# EAGLE design BitBang Rev 1 - Route 1 (EAGLE 5.11)
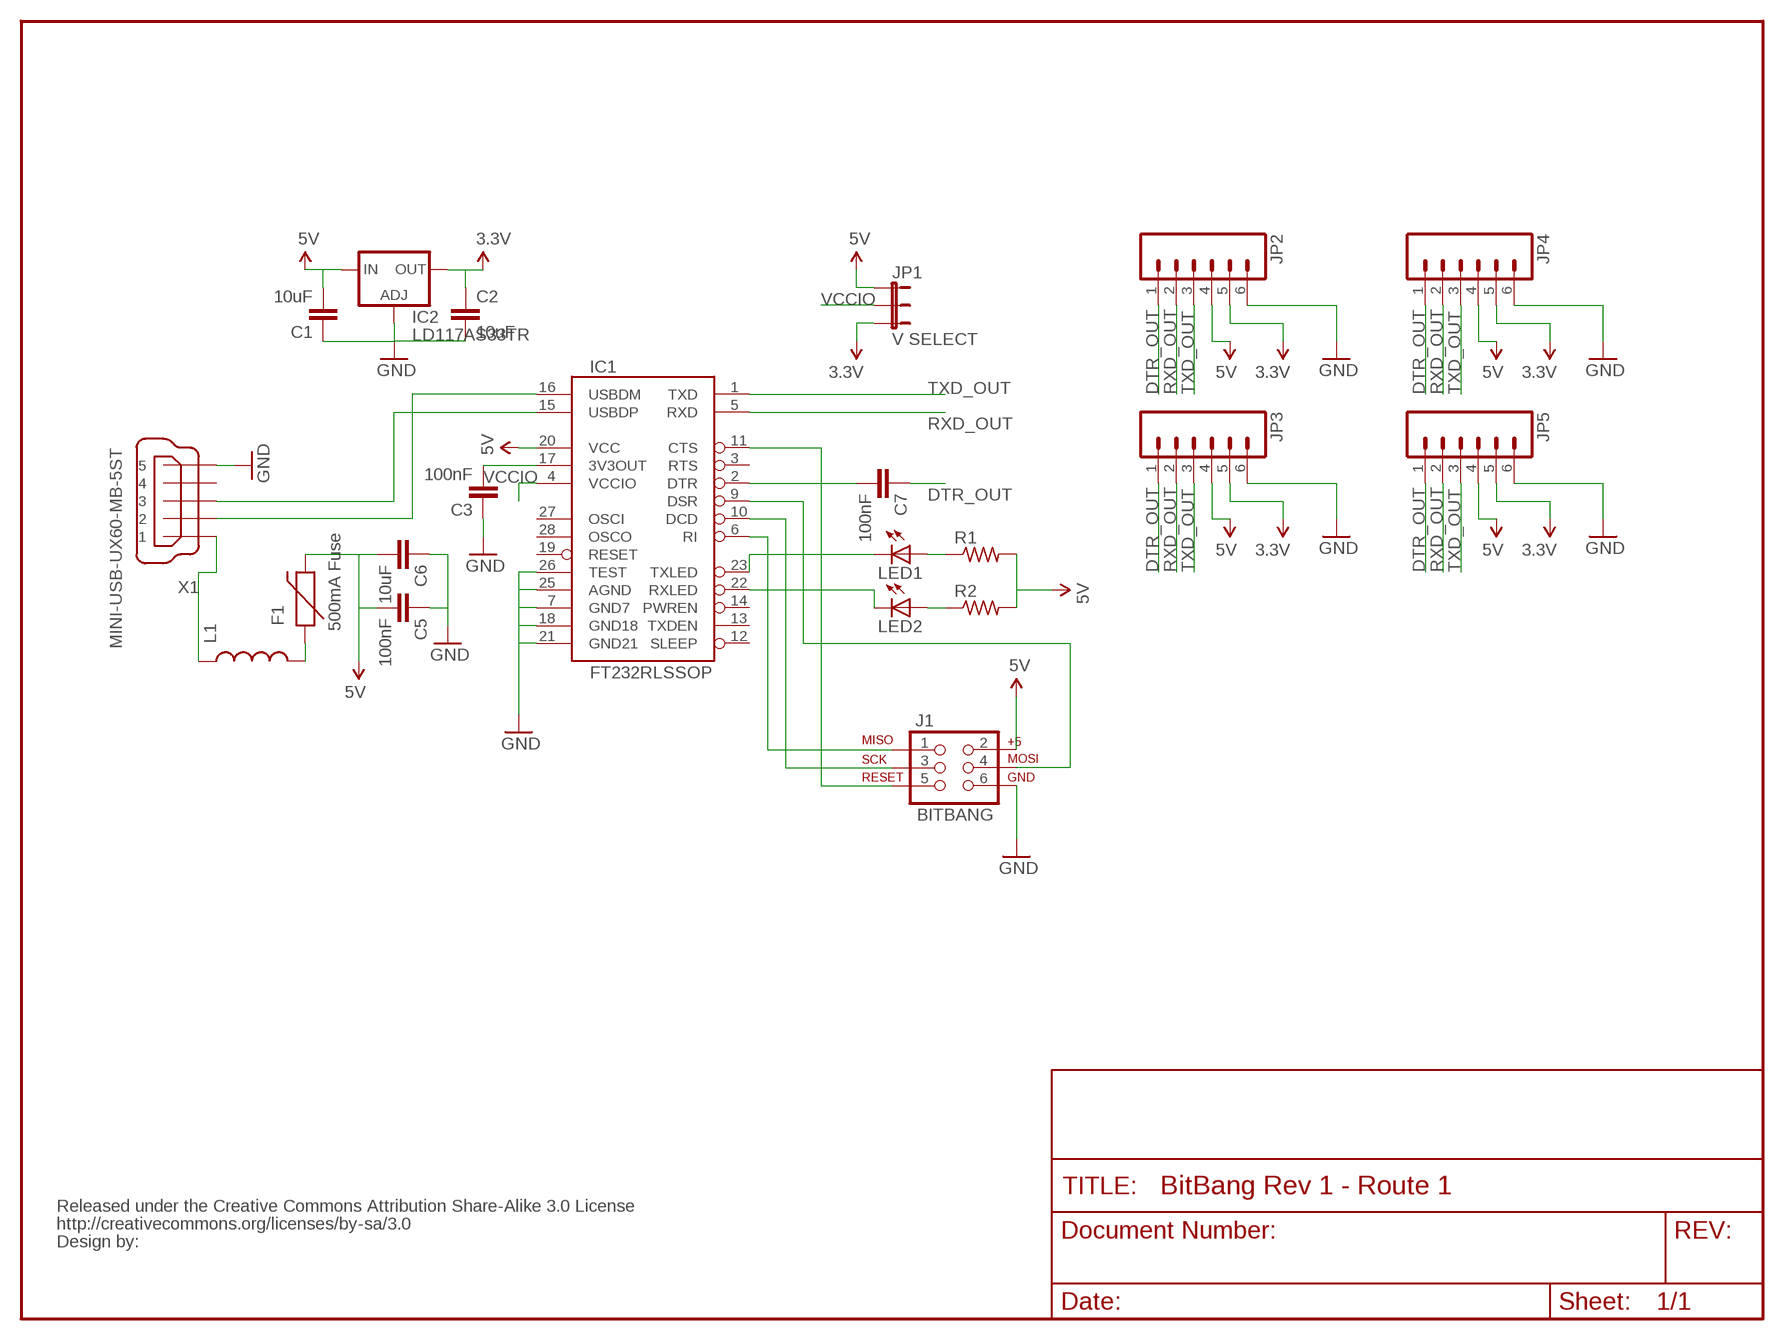
[diagram p0: schematic, sheet 1]

## Parts
C1  10uF  CAP0805  [0805]
C2  10uF  CAP0805  [0805]
C3  100nF  CAP0805  [0805]
C5  100nF  CAP0805  [0805]
C6  10uF  CAP0805  [0805]
C7  100nF  CAP0805  [0805]
F1  500mA Fuse  PTCSMD  [PTC-1206]
IC1  FT232RLSSOP  [SSOP28DB]
IC2  LD117AS33TR  [SOT223]
J1  BITBANG  AVR_SPI_PRG_6NS  [2X3-NS]
JP1  V SELECT  JUMPER-3PTH  [1X03]
JP2  M06SIP  [1X06]
JP3  M06SIP  [1X06]
JP4  M06SIP  [1X06]
JP5  M06SIP  [1X06]
L1  INDUCTOR0805  [0805]
LED1  LEDCHIP-LED0805  [CHIP-LED0805]
LED2  LEDCHIP-LED0805  [CHIP-LED0805]
R1  R-US_R0805  [R0805]
R2  R-US_R0805  [R0805]
U$6  CREATIVE_COMMONS  [CREATIVE_COMMONS]
X1  MINI-USB-UX60-MB-5ST  [UX60-MB-5ST]

## Nets
3.3V: C2.1 IC2.4(OUT) JP1.3 JP2.5 JP3.5 JP4.5 JP5.5
5V: C1.2 C5.2 C6.2 F1.2 IC1.20(VCC) IC2.3(IN) J1.2 JP1.1 JP2.4 JP3.4 JP4.4 JP5.4 R1.2 R2.2
DTR_OUT: C7.1 JP2.1 JP3.1 JP4.1 JP5.1
GND: C1.1 C2.2 C3.1 C5.1 C6.1 IC1.7(GND7) IC1.18(GND18) IC1.21(GND21) IC1.25(AGND) IC1.26(TEST) IC2.1(ADJ) J1.6 JP2.6 JP3.6 JP4.6 JP5.6 X1.5
N$1: IC1.16(USBDM) X1.2
N$2: IC1.15(USBDP) X1.3
N$3: F1.1 L1.2
N$4: C7.2 IC1.2(DTR)
N$5: IC1.11(CTS) J1.5
N$6: IC1.9(DSR) J1.4
N$7: IC1.10(DCD) J1.3
N$8: C3.2 IC1.17(3V3OUT)
N$9: IC1.6(RI) J1.1
N$10: L1.1 X1.1
N$13: IC1.23(TXLED) LED1.C
N$14: IC1.22(RXLED) LED2.C
N$15: LED1.A R1.1
N$16: LED2.A R2.1
RXD_OUT: IC1.5(RXD) JP2.2 JP3.2 JP4.2 JP5.2
TXD_OUT: IC1.1(TXD) JP2.3 JP3.3 JP4.3 JP5.3
VCCIO: IC1.4(VCCIO) JP1.2
Unconnected: IC1.3(RTS) IC1.12(SLEEP) IC1.13(TXDEN) IC1.14(PWREN) IC1.19(RESET) IC1.27(OSCI) IC1.28(OSCO) X1.4

## Library data of the parts
C1-C3 C5-C7 = SparkFun:CAP: Capacitor Standard 0603 ceramic capacitor, and 0.1" leaded capacitor.
F1 = SparkFun:PTC: Resettable Fuse PTC Resettable Fuse. Spark Fun Electronics SKU : COM-08357
IC1 = SparkFun:FT232RL: USB UART FT232RL 4th Generation USB UART (USB <-> Serial) Controller. Spark Fun Electronics SKU : COM-00650
IC2 = v-reg:LD117A?*: Low drop fixed and adjustable positive voltage regulators 1 A Source: http://www.st.com/stonline/products/literature/ds/7194/ld1117axx.pdf
J1 = SparkFun:AVR_SPI_PRG_6: AVR ISP 6 Pin This is the reduced ISP connector for AVR programming. Common on Arduino. This footprint will take up less PCB space and can be used with a 10-pin to 6-pin adapter such as SKU: BOB-08508
JP1 = SparkFun:JUMPER-3
JP2-JP5 = SparkFun:M06: Header 6 Standard 6-pin 0.1" header. Use with straight break away headers (SKU : PRT-00116), right angle break away headers (PRT-00553), swiss pins (PRT-00743), machine pins (PRT-00117), and female headers (PRT-00115). Molex polarized connector foot print use with SKU : PRT-08094 with associated crimp pins and housings. NOTES ON THE VARIANTS LOCK and LOCK_LONGPADS... This footprint was designed to help hold the alignment of a through-hole component (i.e. 6-pin header) while soldering it into place. You may notice that each hole has been shifted either up or down by 0.005 of an inch from it's more standard position (which is a perfectly straight line). This slight alteration caused the pins (the squares in the middle) to touch the edges of the holes. Because they are alternating, it causes a "brace" to hold the component in place. 0.005 has proven to be the perfect amount of "off-center" position when using our standard breakaway headers. Although looks a little odd when you look at the bare footprint, once you have a header in there, the alteration is very hard to notice. Also, if you push a header all the way into place, it is covered up entirely on the bottom side. This idea of altering the position of holes to aid alignment will be further integrated into the Sparkfun Library for other footprints. It can help hold any component with 3 or more connection pins.
L1 = SparkFun:INDUCTOR: Inductors Basic Inductor/Choke - 0603 and 1206. Footprints are not proven and vary greatly between part numbers.
LED1 LED2 = led:LED: LED OSRAM: - CHIPLED LG R971, LG N971, LY N971, LG Q971, LY Q971, LO R971, LY R971 LH N974, LH R974 LS Q976, LO Q976, LY Q976 LO Q996 - Hyper CHIPLED LW Q18S LB Q993, LB Q99A, LB R99A - SideLED LS A670, LO A670, LY A670, LG A670, LP A670 LB A673, LV A673, LT A673, LW A673 LH A674 LY A675 LS A676, LA A676, LO A676, LY A676, LW A676 LS A679, LY A679, LG A679 - Hyper Micro SIDELED® LS Y876, LA Y876, LO Y876, LY Y876 LT Y87S - SmartLED LW L88C, LW L88S LB L89C, LB L89S, LG L890 LS L89K, LO L89K, LY L89K LS L896, LA L896, LO L896, LY L896 - TOPLED LS T670, LO T670, LY T670, LG T670, LP T670 LSG T670, LSP T670, LSY T670, LOP T670, LYG T670 LG T671, LOG T671, LSG T671 LB T673, LV T673, LT T673, LW T673 LH T674 LS T676, LA T676, LO T676, LY T676, LB T676, LH T676, LSB T676, LW T676 LB T67C, LV T67C, LT T67C, LS T67K, LO T67K, LY T67K, LW E67C LS E67B, LA E67B, LO E67B, LY E67B, LB E67C, LV E67C, LT E67C LW T67C LS T679, LY T679, LG T679 LS T770, LO T770, LY T770, LG T770, LP T770 LB T773, LV T773, LT T773, LW T773 LH T774 LS E675, LA E675, LY E675, LS T675 LS T776, LA T776, LO T776, LY T776, LB T776 LHGB T686 LT T68C, LB T68C - Hyper Mini TOPLED® LB M676 - Mini TOPLED Santana® LG M470 LS M47K, LO M47K, LY M47K Source: http://www.osram.convergy.de LUXEON: - LUMILED® LXK2-PW12-R00, LXK2-PW12-S00, LXK2-PW14-U00, LXK2-PW14-V00 LXK2-PM12-R00, LXK2-PM12-S00, LXK2-PM14-U00 LXK2-PE12-Q00, LXK2-PE12-R00, LXK2-PE12-S00, LXK2-PE14-T00, LXK2-PE14-U00 LXK2-PB12-K00, LXK2-PB12-L00, LXK2-PB12-M00, LXK2-PB14-N00, LXK2-PB14-P00, LXK2-PB14-Q00 LXK2-PR12-L00, LXK2-PR12-M00, LXK2-PR14-Q00, LXK2-PR14-R00 LXK2-PD12-Q00, LXK2-PD12-R00, LXK2-PD12-S00 LXK2-PH12-R00, LXK2-PH12-S00 LXK2-PL12-P00, LXK2-PL12-Q00, LXK2-PL12-R00 Source: www.luxeon.com KINGBRIGHT: KA-3528ASYC Source: www.kingbright.com
R1 R2 = resistor:R-US_: RESISTOR, American symbol
U$6 = SparkFun:CREATIVE_COMMONS
X1 = con-hirose:MINI-USB-: MINI USB Connector Source: http://www.hirose.co.jp/cataloge_hp/e24000019.pdf; OC_FARNELL: unknown; OC_NEWARK: unknown

## Board
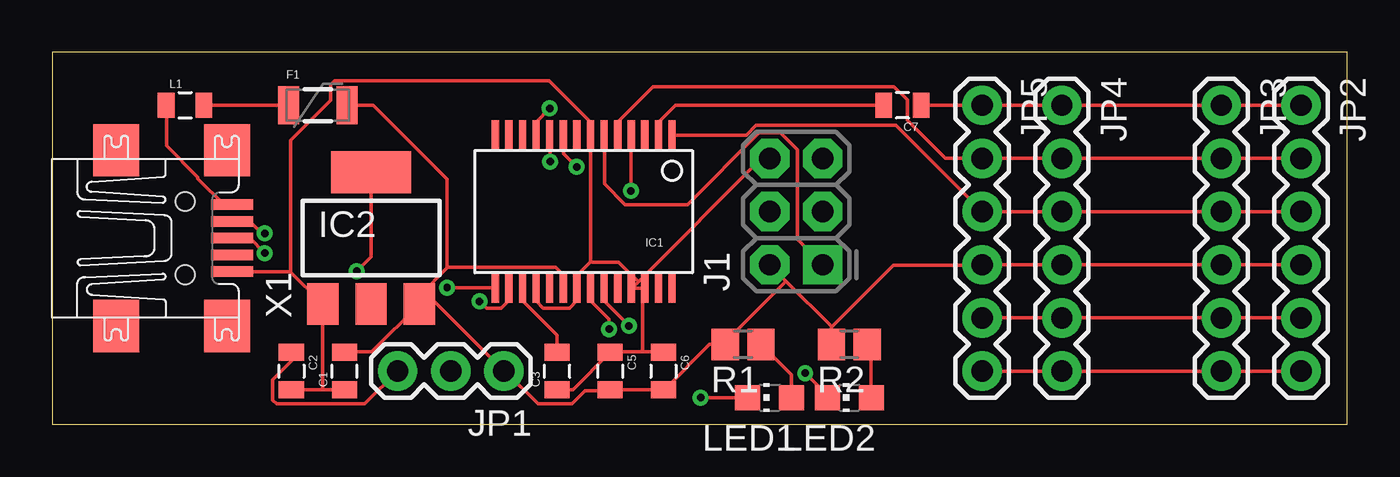
[diagram p1: board, top side]
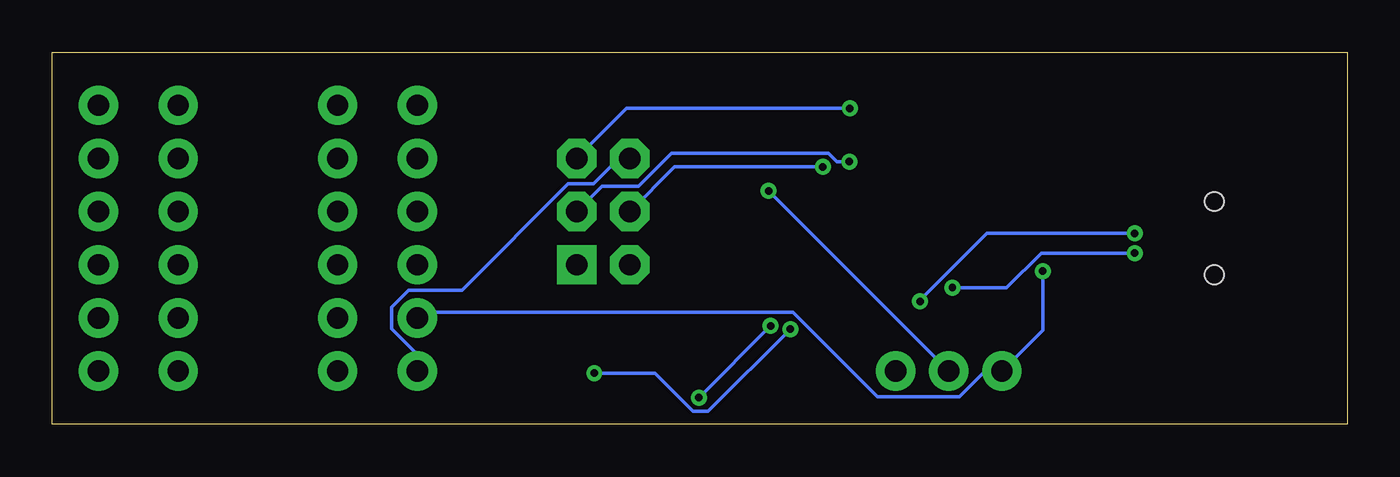
[diagram p2: board, bottom side, seen from below]

Size 61.9 x 17.77 mm. Coordinates in mm from the lower left corner, seen from the top.
Outline: 0,0 61.9,0 61.9,17.77 0,17.77 0,0
Copper layers (1*16): Top 0.0356mm / dielectric 1.5011mm / Bottom 0.0356mm
Design rules "SilverCircuits": minimum track width 7mil, minimum drill 14mil, track to track 7mil, track to pad 7mil, pad to pad 7mil, via to via 7mil, smd to smd 0mil, copper to edge 20mil, drill to drill 8mil, minimum pad ring 10mil, minimum via ring 8mil, stop-mask expansion 4mil, vias tented up to drill 0mil, thermal gap 10mil

### Footprints (pad centres in the part's own frame; a part is rotated, then mirrored left to right if it is on the bottom)
0805 = smd 0.8 x 1.2: 1 -0.9,0; 2 0.9,0
PTC-1206 = smd 1 x 1.8: 1 -1.4,0; 2 1.4,0
SSOP28DB = smd 0.348 x 1.397: 1 -4.225,-3.656; 2 -3.575,-3.656; 3 -2.925,-3.656; 4 -2.275,-3.656; 5 -1.625,-3.656; 6 -0.975,-3.656; 7 -0.325,-3.656; 8 0.325,-3.656; 9 0.975,-3.656; 10 1.625,-3.656; 11 2.275,-3.656; 12 2.925,-3.656; 13 3.575,-3.656; 14 4.225,-3.656; 15 4.225,3.656; 16 3.575,3.656; 17 2.925,3.656; 18 2.275,3.656; 19 1.625,3.656; 20 0.975,3.656; 21 0.325,3.656; 22 -0.325,3.656; 23 -0.975,3.656; 24 -1.625,3.656; 25 -2.275,3.656; 26 -2.925,3.656; 27 -3.575,3.656; 28 -4.225,3.656
SOT223 = smd 1.5 x 2: 1 -2.3,-3.15; 2 0,-3.15; 3 2.3,-3.15 | smd 3.8 x 2: 4 0,3.15
2X3-NS = drill 1.016 pad 1.88 square: 1 -2.54,-1.27 | drill 1.016 pad 1.88 octagon: 2 -2.54,1.27; 3 0,-1.27; 4 0,1.27; 5 2.54,-1.27; 6 2.54,1.27
1X03 = drill 1.016 pad 1.88 round: 1 0,0; 2 2.54,0; 3 5.08,0
1X06 = drill 1.016 pad 1.88 round: 1 0,0; 2 2.54,0; 3 5.08,0; 4 7.62,0; 5 10.16,0; 6 12.7,0
CHIP-LED0805 = smd 1.2 x 1.2: A 0,-1.05; C 0,1.05
R0805 = smd 1.3 x 1.5: 1 -0.85,0; 2 0.85,0
UX60-MB-5ST = smd 2 x 0.5: 1 2.25,1.6; 2 2.25,0.8; 3 2.25,0; 4 2.25,-0.8; 5 2.25,-1.6 | smd 2.2 x 2.5: M1 -3.3,-4.2; M2 -3.3,4.2; M3 2,4.2; M4 2,-4.2 | hole 0.9: 0,-1.75; 0,1.75

### Placement (x,y rotation side)
C1  13.97,2.54 90 top
C2  11.43,2.54 270 top
C3  24.13,2.54 90 top
C5  26.67,2.54 270 top
C6  29.21,2.54 270 top
C7  40.64,15.24 180 top
F1  12.7,15.24 0 top
IC1  25.4,10.16 180 top
IC2  15.24,8.89 0 top
J1  35.56,10.16 90 top
JP1  21.59,2.54 180 top
JP2  59.69,15.24 270 top
JP3  55.88,15.24 270 top
JP4  48.26,15.24 270 top
JP5  44.45,15.24 270 top
L1  6.35,15.24 0 top
LED1  34.29,1.27 90 top
LED2  38.1,1.27 90 top
R1  33.02,3.81 180 top
R2  38.1,3.81 180 top
U$6  -77.47,24.13 0 top  (outside the outline)
X1  6.35,8.89 0 top

### Tracks (layer width: path | path; a pad name or v marks a point on that pad's centre or on a via)
3.3V  (via drill 0.36)
  Top 0.178: JP1.3 14.94,0.96 10.72,0.96 10.54,1.14 10.54,2.13 11.43,3.02 C2.1 | v14.55,7.32 15.24,8 IC2.4 | JP5.5 JP4.5 JP3.5 JP2.5
  Bottom 0.178: v14.55,7.32 14.55,4.5 JP1.3 16.59,2.52 17.35,2.52 18.54,1.32 22.45,1.32 26.49,5.36 44.17,5.36 JP5.5
5V
  Top 0.178: JP2.4 JP3.4 JP4.4 JP5.4 44.37,7.59 40.21,7.59 37.31,4.7 37.24,4.67 | 37.24,4.67 37.24,3.81 R2.2 | 35.08,6.83 J1.2 | 35.08,6.83 37.24,4.67 | 35.08,6.83 32.21,3.96 32.21,3.89 R1.2 31.42,3.81 29.29,1.68 C6.2 29.21,1.65 26.67,1.65 C5.2 26.59,1.6 25.48,1.6 24.84,0.96 23.22,0.96 21.67,2.52 JP1.1 17.8,6.33 IC2.3 | C1.2 13.97,3.45 15.27,3.45 17.53,5.71 IC2.3 | 18.9,7.49 24.05,7.49 24.41,7.14 24.41,6.53 IC1.20 | 18.9,7.49 17.58,6.17 17.58,5.82 IC2.3 | F1.2 15.34,15.24 18.87,11.71 18.87,7.57 18.9,7.49
DTR_OUT
  Top 0.178: JP2.1 JP3.1 JP4.1 JP5.1 C7.1
GND
  Top 0.178: JP5.6 JP4.6 JP3.6 JP2.6 | 12.93,1.65 13.97,1.65 C1.1 | 12.93,1.65 11.43,1.65 C2.2 | 12.93,1.65 12.93,5.71 IC2.1 12.88,5.79 11.38,7.29 | 11.38,7.29 8.61,7.29 X1.5 | IC1.18 23.14,6.5 23.14,5.87 23.47,5.54 24.71,5.54 25.07,5.89 IC1.21 25.12,6.58 25.12,7.16 25.73,7.77 | 25.73,7.77 25.73,13.79 IC1.7 25.68,13.89 25.68,14.48 23.75,16.41 13.49,16.41 13.31,16.23 13.31,15.47 11.4,13.56 11.4,7.37 11.38,7.29 | C3.1 24.13,1.65 24.89,1.65 26.67,3.43 C5.1 26.75,3.45 28.22,3.45 | 28.22,3.45 29.21,3.45 C6.1 | 28.22,3.45 28.22,6.43 IC1.26 27.69,6.5 IC1.25 27.79,6.58 28.02,6.81 | J1.6 33.91,12.7 28.02,6.81 | 25.73,7.77 25.81,7.75 27.08,7.75 28.02,6.81
  Bottom 0.178: JP5.6 44.45,3.35 45.67,4.57 45.67,5.59 44.86,6.4 42.32,6.4 37.24,11.48 36.02,11.48 34.8,12.7 J1.6
N$1  (via drill 0.36)
  Top 0.178: v20.42,5.87 20.75,5.54 21.46,5.54 21.82,5.89 IC1.16 | v10.16,9.12 10.01,9.12 9.45,9.68 8.61,9.68 X1.2
  Bottom 0.178: v20.42,5.87 20.42,5.92 17.22,9.12 v10.16,9.12
N$2  (via drill 0.36)
  Top 0.178: v18.87,6.53 21.16,6.53 IC1.15 | v10.16,8.18 9.45,8.89 X1.3
  Bottom 0.178: v18.87,6.53 16.28,6.53 14.63,8.18 v10.16,8.18
N$3
  Top 0.178: L1.2 F1.1
N$4
  Top 0.178: C7.2 29.79,15.24 28.98,14.43 28.98,13.82 IC1.2
N$5  (via drill 0.36)
  Top 0.178: v23.77,15.09 23.14,14.45 23.14,13.82 IC1.11
  Bottom 0.178: v23.77,15.09 34.44,15.09 J1.5
N$6  (via drill 0.36)
  Top 0.178: v25.07,12.29 24.43,12.93 24.43,13.79 IC1.9
  Bottom 0.178: v25.07,12.29 32.16,12.29 J1.4
N$7  (via drill 0.36)
  Top 0.178: v23.8,12.55 23.8,13.79 IC1.10
  Bottom 0.178: v23.8,12.55 24.38,12.55 24.79,12.95 32.31,12.95 33.88,11.38 35.61,11.38 J1.3
N$8
  Top 0.178: C3.2 24.13,4.24 22.48,5.89 IC1.17
N$9
  Top 0.178: J1.1 35.61,8.84 35.61,13.11 34.8,13.92 33.78,13.92 30.35,10.49 27.38,10.49 26.39,11.48 26.39,13.79 IC1.6
N$10
  Top 0.178: L1.1 5.46,15.24 5.46,13.31 6.96,11.81 6.96,11.73 8.2,10.49 8.59,10.49 X1.1
N$13  (via drill 0.36)
  Top 0.178: v27.56,4.7 26.39,5.87 IC1.23 | v30.99,1.27 LED1.C
  Bottom 0.178: v27.56,4.7 v30.99,1.27
N$14  (via drill 0.36)
  Top 0.178: v35.99,2.44 37.03,1.4 37.03,1.27 LED2.C | v26.62,4.55 26.62,5 25.73,5.89 IC1.22
  Bottom 0.178: v35.99,2.44 33.1,2.44 31.27,0.61 30.56,0.61 v26.62,4.55
N$15
  Top 0.178: LED1.A 35.33,2.36 33.88,3.81 R1.1
N$16
  Top 0.178: LED2.A 39.14,3.63 38.96,3.81 R2.1
RXD_OUT
  Top 0.178: JP2.2 JP3.2 JP4.2 JP5.2 42.7,12.7 40.87,14.53 40.87,15.49 40.23,16.13 28.73,16.13 27.03,14.43 IC1.5
TXD_OUT
  Top 0.178: JP2.3 JP3.3 JP4.3 JP5.3 40.34,14.28 33.63,14.28 33.17,13.82 29.64,13.82 IC1.1
VCCIO  (via drill 0.36)
  Top 0.178: v27.66,11.15 27.66,13.79 IC1.4
  Bottom 0.178: JP1.2 v27.66,11.15